# Altium schematic sheet FieldBUS_RTU.SchDoc
size A4; SheetNumber: 10; SheetTotal: 14
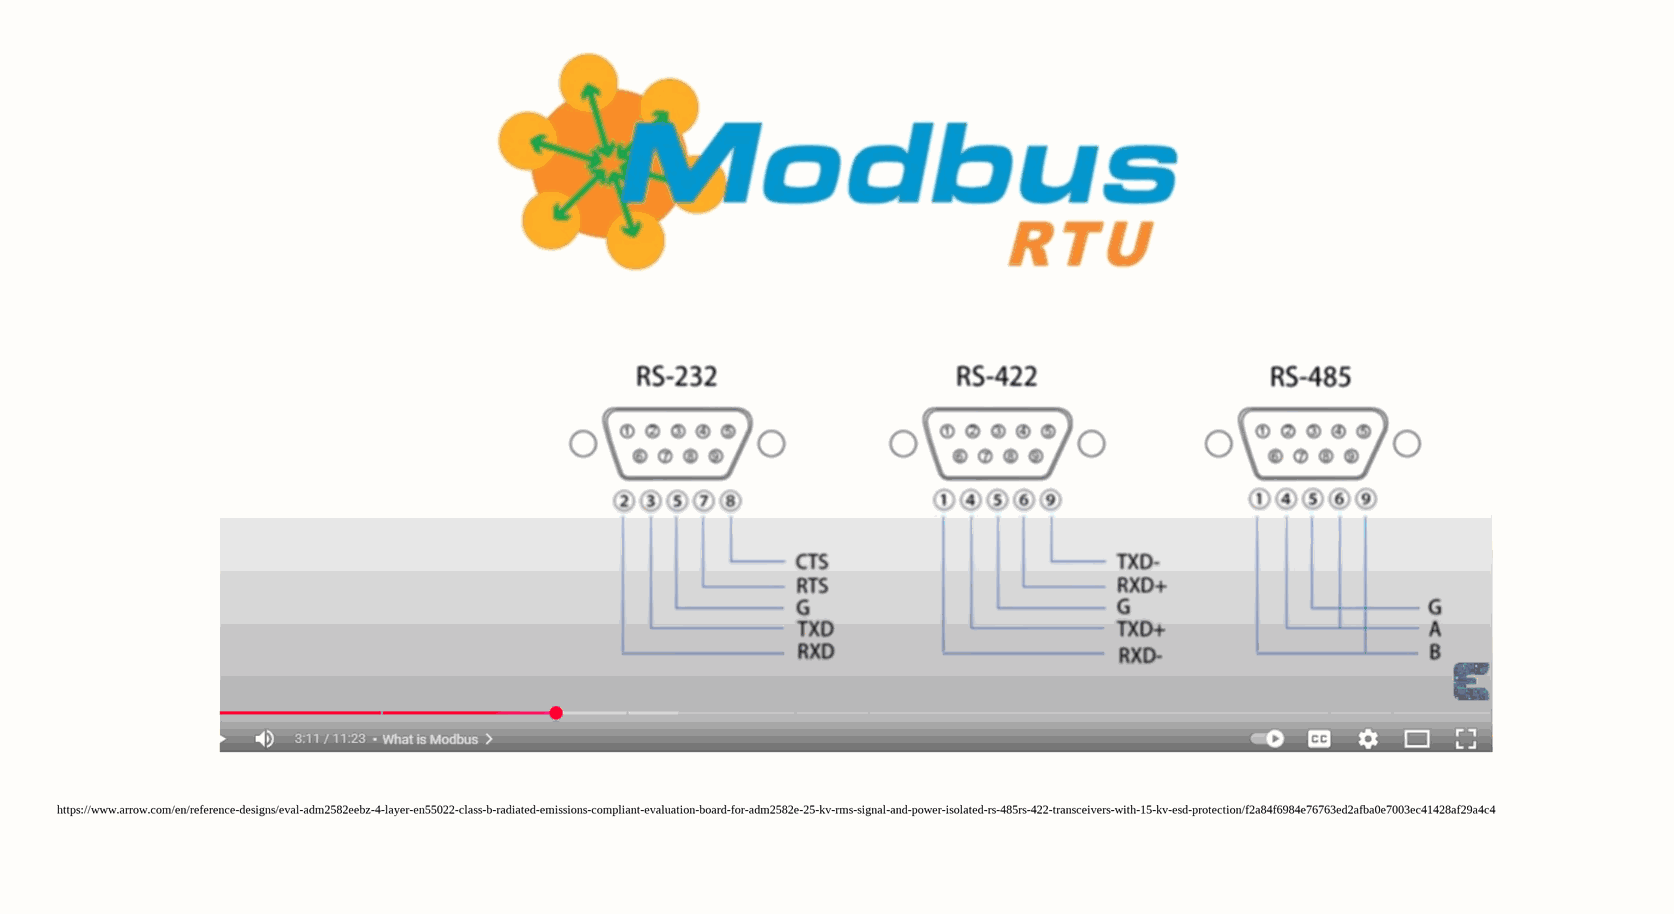
[diagram p0: FieldBUS_RTU.SchDoc, top left]
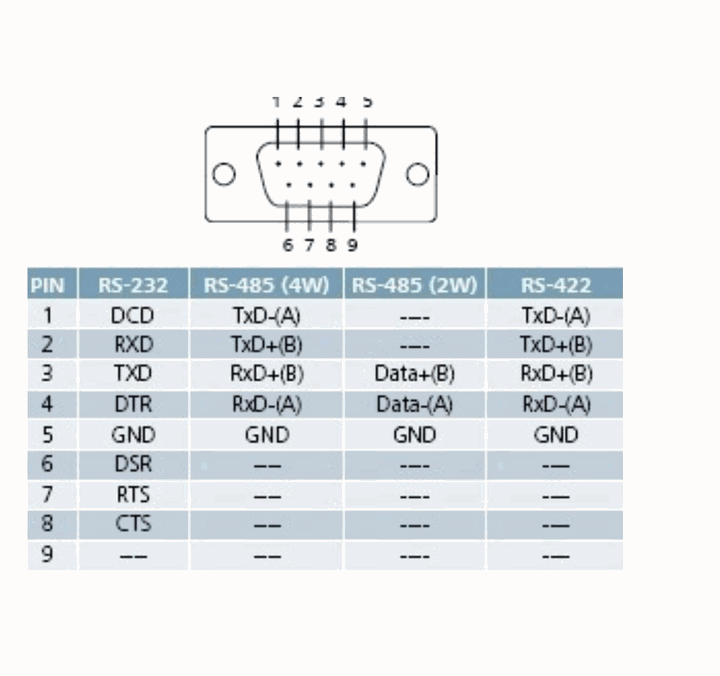
[diagram p1: FieldBUS_RTU.SchDoc, top right]
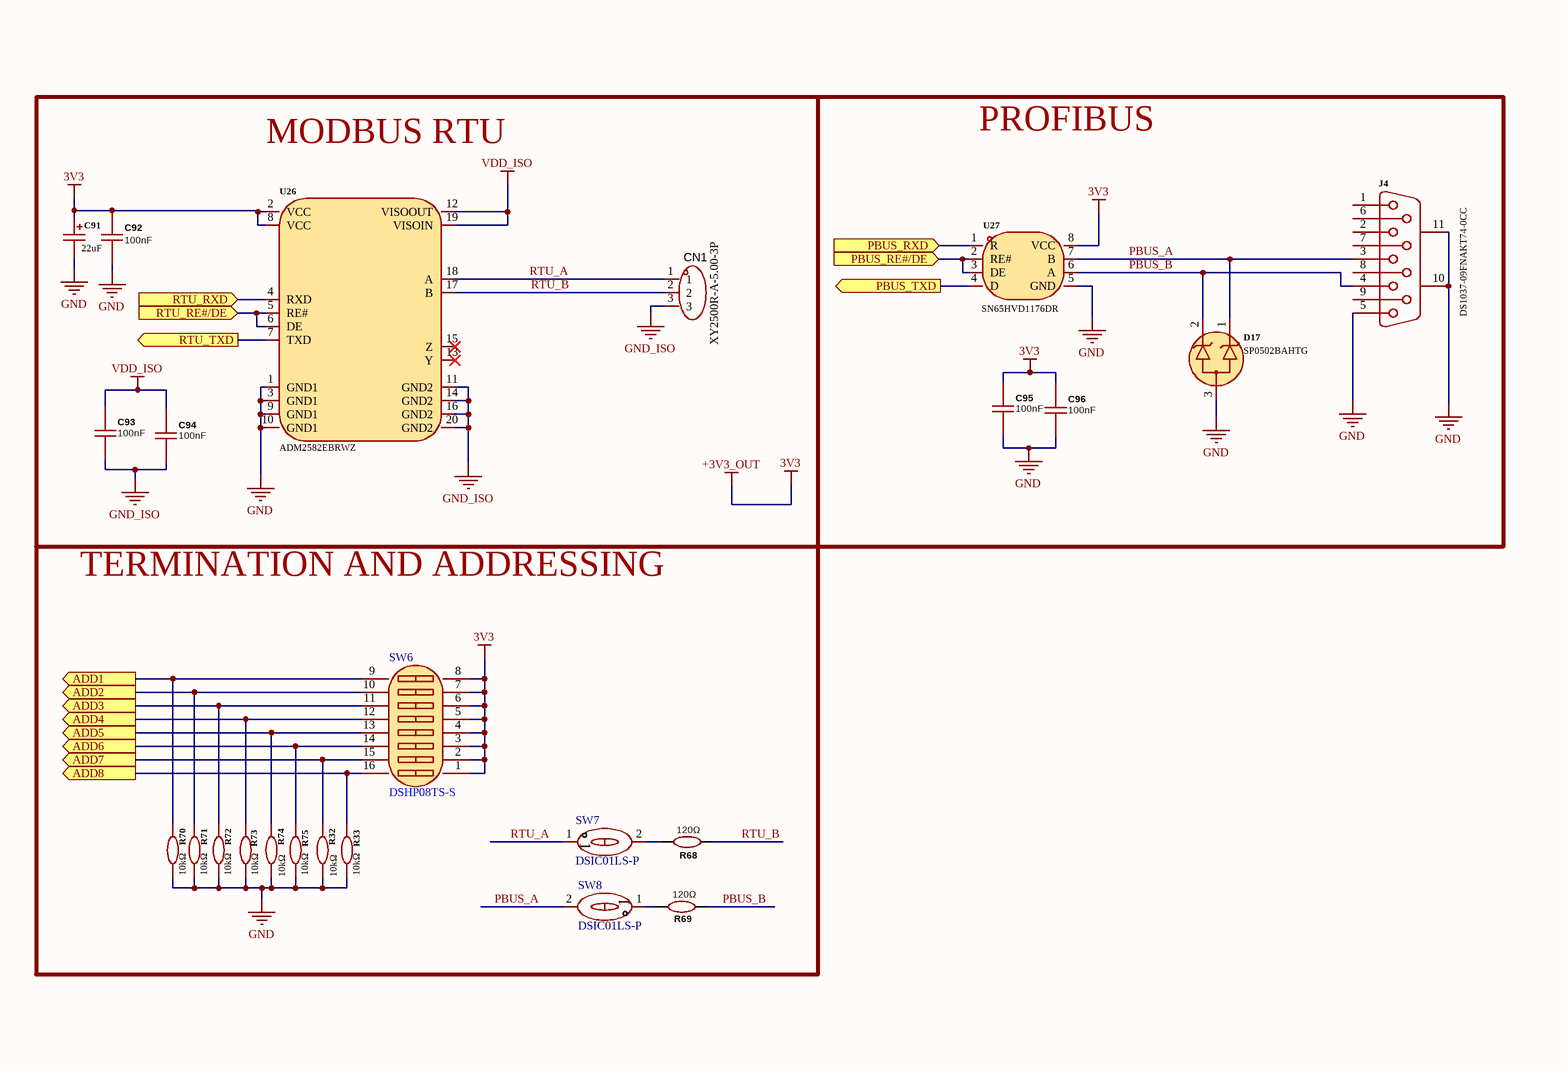
[diagram p2: FieldBUS_RTU.SchDoc, bottom left]
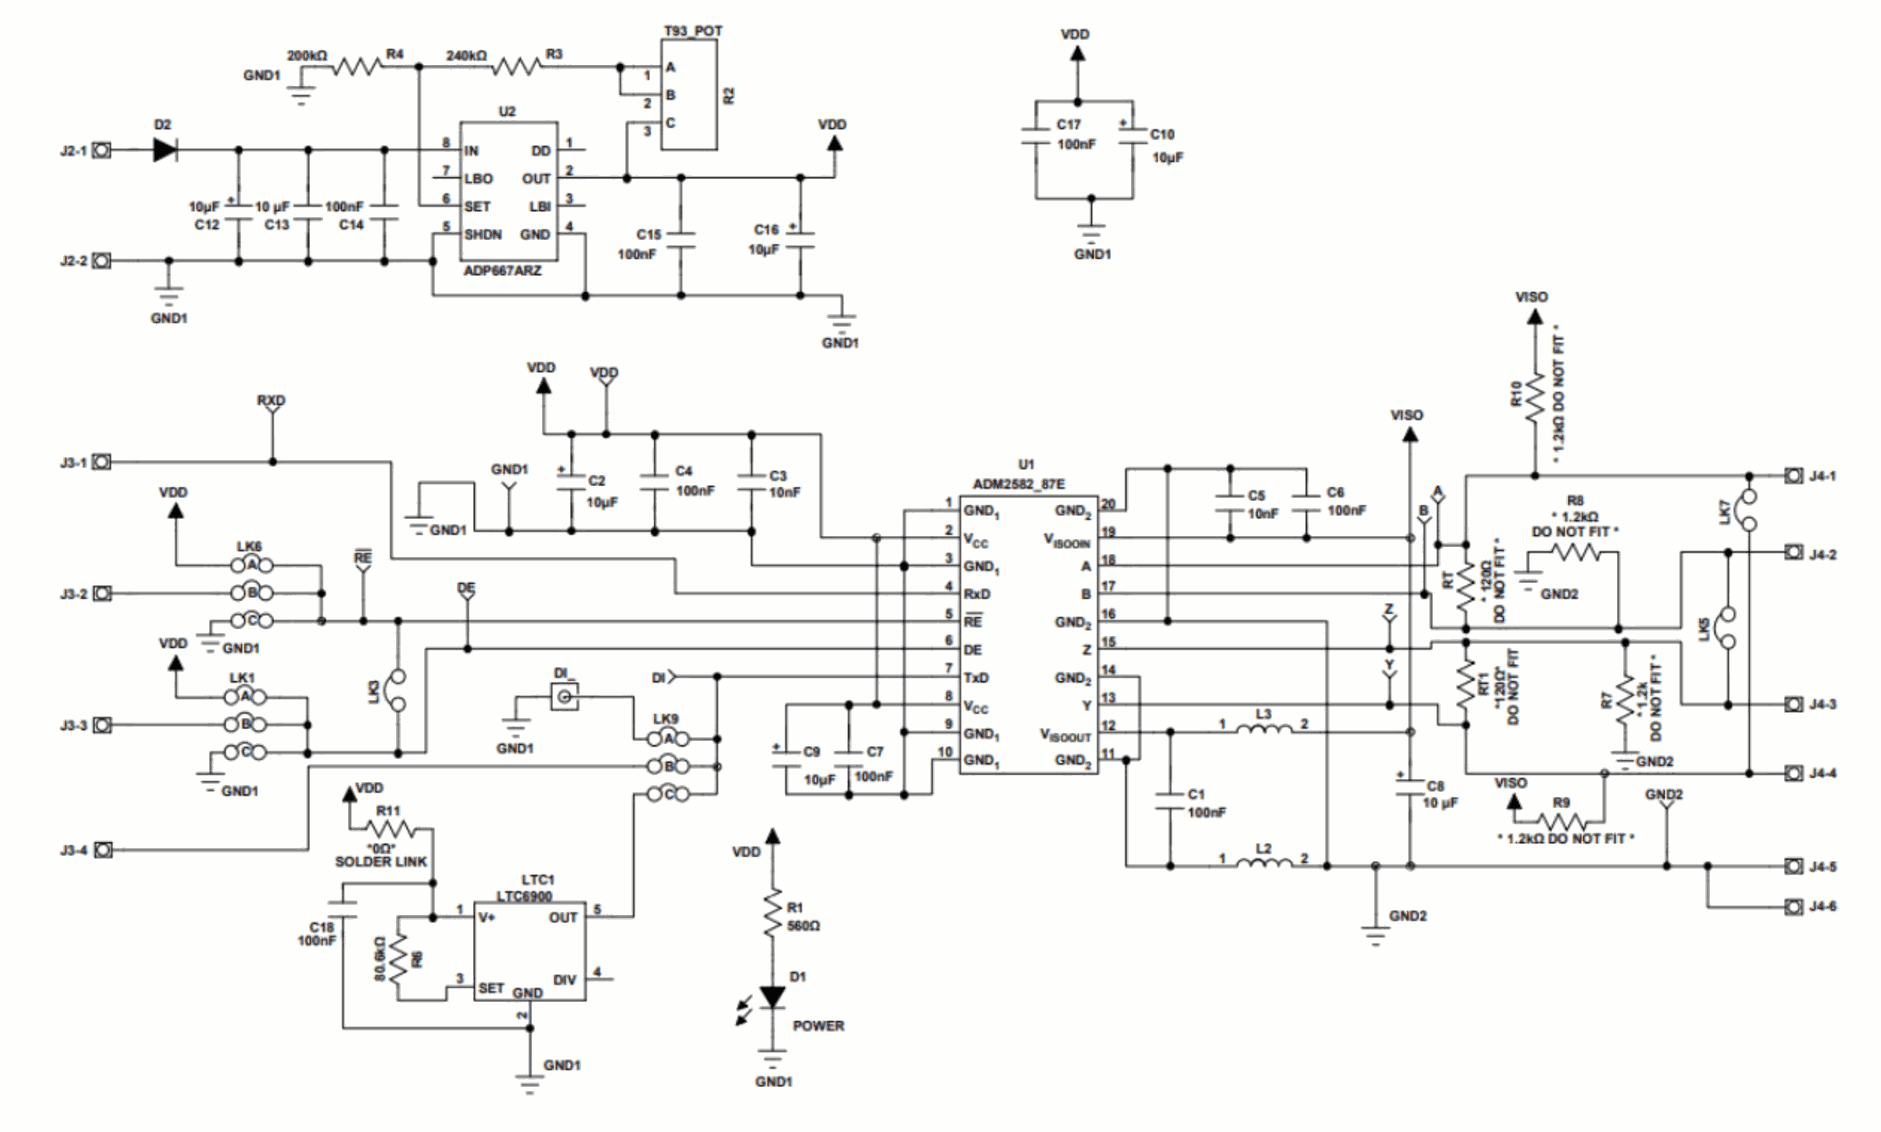
[diagram p3: FieldBUS_RTU.SchDoc, bottom right]

## Parts
C91  22uF  [CASE-A_3216]
C92  100nF  [C_0805]
C93  100nF  [C_0805]
C94  100nF  [C_0805]
C95  100nF  [C_0805]
C96  100nF  [C_0805]
CN1  XY2500R-A-5.00-3P  [CONN-TH_XY2500R-A-5.00-3P]
D17  SP0502BAHTG  [SOT-23-3_L2.9-W1.3-P1.90-LS2.4-BR]
J4  DS1037-09FNAKT74-0CC  [DSUB-TH_DS1037-09FNAKT74-0CC]
R32  10kΩ  [R_0603]
R33  10kΩ  [R_0603]
R68  120Ω  [R_1206]
R69  120Ω  [R_1206]
R70  10kΩ  [R_0603]
R71  10kΩ  [R_0603]
R72  10kΩ  [R_0603]
R73  10kΩ  [R_0603]
R74  10kΩ  [R_0603]
R75  10kΩ  [R_0603]
SW6  DSHP08TS-S  [SW-SMD_DSHP08TS-S]
SW7  DSIC01LS-P  [SW-SMD_2P-L3.5-W6.1-P2.54-LS9.8]
SW8  DSIC01LS-P  [SW-SMD_2P-L3.5-W6.1-P2.54-LS9.8]
U26  ADM2582EBRWZ  [SOIC-20_L13.0-W7.6-P1.27-LS10.3-BL]
U27  SN65HVD1176DR  [SOIC-8_L5.0-W4.0-P1.27-LS6.0-BL]

## Ports
ADD1 (out), ADD2 (out), ADD3 (out), ADD4 (out), ADD5 (out), ADD6 (out), ADD7 (out), ADD8 (out), PBUS_RE#/DE (in), PBUS_RXD (in), PBUS_TXD (out), RTU_RE#/DE (in), RTU_RXD (in), RTU_TXD (out)

## Nets
+3V3_OUT: C91.1 C92.2 C95.2 C96.2 SW6.1(A1) SW6.2(A2) SW6.3(A3) SW6.4(A4) SW6.5(A5) SW6.6(A6) SW6.7(A7) SW6.8(A8) U26.2(VCC) U26.8(VCC) U27.8(VCC)  [also labelled 3V3]
GND: C91.2 C92.1 C95.1 C96.1 D17.3(A) J4.5 J4.10(MH1) J4.11(MH2) R32.2 R33.2 R70.2 R71.2 R72.2 R73.2 R74.2 R75.2 U26.1(GND1) U26.3(GND1) U26.9(GND1) U26.10(GND1) U27.5(GND)
GND_ISO: C93.1 C94.1 CN1.3 U26.11(GND2) U26.14(GND2) U26.16(GND2) U26.20(GND2)
VDD_ISO: C93.2 C94.2 U26.12(VISOOUT) U26.19(VISOIN)
ADD1: R70.1 SW6.9(B8) ; port ADD1
ADD2: R71.1 SW6.10(B7) ; port ADD2
ADD3: R72.1 SW6.11(B6) ; port ADD3
ADD4: R73.1 SW6.12(B5) ; port ADD4
ADD5: R74.1 SW6.13(B4) ; port ADD5
ADD6: R75.1 SW6.14(B3) ; port ADD6
ADD7: R32.1 SW6.15(B2) ; port ADD7
ADD8: R33.1 SW6.16(B1) ; port ADD8
PBUS_A: D17.1(K1) J4.3 SW8.2(PIN2) U27.7(B)
PBUS_B: D17.2(K2) J4.4 R69.2 U27.6(A)
PBUS_RE#/DE: U27.2(RE#) U27.3(DE) ; port PBUS_RE#/DE
PBUS_RXD: U27.1(R) ; port PBUS_RXD
PBUS_TXD: U27.4(D) ; port PBUS_TXD
RTU_A: CN1.1 SW7.1(PIN1) U26.18(A)
RTU_B: CN1.2 R68.2 U26.17(B)
RTU_RE#/DE: U26.5(RE#) U26.6(DE) ; port RTU_RE#/DE
RTU_RXD: U26.4(RXD) ; port RTU_RXD
RTU_TXD: U26.7(TXD) ; port RTU_TXD
NetR68_1: R68.1 SW7.2(PIN2)
NetR69_1: R69.1 SW8.1(PIN1)

Not connected (* = marked no-connect by the designer): J4 1 2 6 7 8 9; U26 13(Y)* 15(Z)*

## Notes on the sheet
- https://www.arrow.com/en/reference-designs/eval-adm2582eebz-4-layer-en55022-class-b-radiated-emissions-compliant-evaluation-board-for-adm2582e-25-kv-rms-signal-and-power-isolated-rs-485rs-422-transceivers-with-15-kv-esd-protection/f2a84f6984e76763ed2afba0e7003ec41428af29a4c4
- MODBUS RTU
- PROFIBUS
- TERMINATION AND ADDRESSING
- Project Name:
- Size:
- Date:
- A4
- Version:
- Time:
- V1.4.0.0
- Sheet:
- Of
- File:

## Library data of the parts
C91 = TAJA226K010RNJ: Manufacturer: Kyocera AVX; Add into BOM: yes; Tolerance: ±10%; Voltage Rating: 10V; Equivalent Series Resistance(ESR): 3Ω@100kHz; Symbol: TAJA226K010RNJ; Device: TAJA226K010RNJ; LCSC Part Name: 22uF ±10% 10V; Supplier Part: C11366; Manufacturer Part: TAJA226K010RNJ; Supplier Footprint: CASE-A-3216-18(mm); JLCPCB Part Class: Extended Part; Supplier: LCSC; Convert to PCB: yes; Value: 22uF; Operating Temperature: -55℃~+125℃
C92-C96 = 100nF: Manufacturer Part: CC0805KRX7R9BB104; Manufacturer: YAGEO(国巨); nameAlias: Value; Supplier: LCSC; Supplier Part: C49678; JLCPCB Part Class: Basic Part; spicePre: C; spiceSymbolName: CC0805KRX7R9BB104
CN1 = XY2500R-A-5.00-3P: Manufacturer: XINLAIYA(新莱亚); Add into BOM: yes; Connector Type: Board Side/Socket - Open; Number of Positions or Pins: 1x3P; Pitch: 5mm; Number of PINs Per Row: 3; Current Rating: 15A; Voltage Rating (Max): 300V; Symbol: XY2500R-A-5.00-3P; Device: XY2500R-A-5.00-3P; LCSC Part Name: 1x3P 5mm 排数:1 每排P数:3; Supplier Part: C505798; Manufacturer Part: XY2500R-A-5.00-3P; Supplier Footprint: 弯插,P=5mm; JLCPCB Part Class: Extended Part; Datasheet: https://item.szlcsc.com/datasheet/XY2500R-A-5.00-3P/519088.html; Supplier: LCSC; Convert to PCB: yes; Color: Green; Mounting Type: Right-Angle Pin; Number of Pins: 3P; Number of Rows: 1
D17 = SP0502BAHTG: Manufacturer: Littelfuse(美国力特); Add into BOM: yes; Polarity: Unidirectional; Reverse Stand-Off Voltage (Vrwm): 5.5V; Clamping Voltage: 12V; Reverse Leakage Current (Ir): 100nA; Number of Channels: 2; level of protection: IEC 61000-4-2; Type: TVS; Junction Capacitance: 30pF; Symbol: SP0502BAHTG; Device: SP0502BAHTG; LCSC Part Name: SP0502BAHTG; Supplier Part: C207261; Manufacturer Part: SP0502BAHTG; Supplier Footprint: SOT-23; JLCPCB Part Class: Extended Part; Datasheet: https://item.szlcsc.com/datasheet/SP0502BAHTG/208380.html; Supplier: LCSC; Convert to PCB: yes; Peak Pulse Current (Ipp): -; Peak Pulse Power Dissipation (Ppp): -; Voltage - Breakdown: -; Operating Temperature: -40℃~+125℃
J4 = DS1037-09FNAKT74-0CC: Manufacturer: CONNFLY; Add into BOM: yes; Connector Type: Standard D-Sub; Gender: Mother; Current Rating-Signal (Max): 3A; Symbol: DS1037-09FNAKT74-0CC; Device: DS1037-09FNAKT74-0CC; LCSC Part Name: D-Sub 母 P数:9P 1200/盒 带六角螺丝; Supplier Part: C75749; Manufacturer Part: DS1037-09FNAKT74-0CC; Supplier Footprint: 弯插; JLCPCB Part Class: Extended Part; Datasheet: https://atta.szlcsc.com/upload/public/pdf/source/20241014/2E52C80238FADC5DB5725AE5600FD7FE.pdf; Supplier: LCSC; Convert to PCB: yes; Number of Pins: 9P; Mounting Style: Bend-in; Number of Rows: 2; Current Rating-Power (Max): -; Rated Voltage (Max): -; Colour: Black; Operating Temperature Range: -40℃~+105℃
R32 R33 R70-R75 = RC0603FR-0710KL: Manufacturer: YAGEO(国巨); Add into BOM: yes; Tolerance: ±1%; Temperature Coefficient: ±100ppm/℃; Symbol: RC0603FR-0710KL; Device: RC0603FR-0710KL; LCSC Part Name: 厚膜电阻 10kΩ ±1% 100mW; Supplier Part: C98220; Manufacturer Part: RC0603FR-0710KL; Supplier Footprint: 0603; JLCPCB Part Class: Extended Part; Datasheet: https://atta.szlcsc.com/upload/public/pdf/source/20180927/C295883_E8D83085EA81BD7DE0B2B681138C15EE.pdf; Supplier: LCSC; Convert to PCB: yes; Type: Thick Film Resistors; Value: 10kΩ; Operating Temperature Range: -55℃~+155℃
R68 R69 = 120Ω: Manufacturer: YAGEO(国巨); Manufacturer Part: RC1206FR-07120RL; nameAlias: Value; Supplier: LCSC; Supplier Part: C114928; JLCPCB Part Class: Extended Part; spicePre: R; spiceSymbolName: RC1206FR-07120RL
SW6 = DSHP08TS-S: Manufacturer: XKB Connectivity(中国星坤); Add into BOM: yes; Circuit: SPST; Number of Positions: 8Bit; Pin Style: Gull Wing; Current Rating: 25mA; Voltage Rating: 24V; Operating Life: 3千次; Symbol: DSHP08TS-S; Device: DSHP08TS-S; Supplier: LCSC; Supplier Part: C319047; Manufacturer Part: DSHP08TS-S; JLCPCB Part Class: Extended Part; LCSC Part Name: 间距1.27mm 平拨,凹槽式 8位拨码开关; Supplier Footprint: SMD-16P,5.4x11.8mm; Datasheet: https://atta.szlcsc.com/upload/public/pdf/source/20211009/11BE85C99D2C85B0991AF4F9D6EB8BDE.pdf; Convert to PCB: yes; Type: 平拨,凹槽式; Lead Pitch: 1.27mm; Operating Temperature: -20℃~+70℃; Color: Black
SW7 SW8 = DSIC01LS-P_C600988: Manufacturer: XKB Connection(中国星坤); Add into BOM: yes; Circuit: SPST; Number of Positions: 1; Current Rating: 25mA; Voltage Rating: 24V; Operating Life: 3,000 Cycles; Symbol: DSIC01LS-P_C600988; Device: DSIC01LS-P_C600988; LCSC Part Name: 平拨,凸起式 1位拨码开关; Supplier Part: C600988; Manufacturer Part: DSIC01LS-P; Supplier Footprint: SMD,6.2x3.5mm; JLCPCB Part Class: Extended Part; Datasheet: https://item.szlcsc.com/datasheet/DSIC01LS-P/631008.html; Supplier: LCSC; Convert to PCB: yes; Type: Slide, Rocked; Termination Style: Gull Wing; Lead Pitch: -; Operating Temperature: -20℃~+70℃; Color: Black
U26 = ADM2582EBRWZ: Manufacturer: ADI(亚德诺); Add into BOM: yes; Communication Mode: Full-Duplex；Half-Duplex; Voltage - Supply: 3.3V；5V; Output Voltage: 3.3V; Isolation Voltage(Vrms): 2500; CMTI(kV/us): 25kV/us; Symbol: ADM2582EBRWZ; Device: ADM2582EBRWZ; LCSC Part Name: 信号和电源隔离的RS-485收发器，具有±15 kV静电放电保护; Supplier Part: C18532; Manufacturer Part: ADM2582EBRWZ; Supplier Footprint: SOIC-20-300mil; JLCPCB Part Class: Extended Part; Datasheet: https://item.szlcsc.com/datasheet/ADM2582EBRWZ/19232.html; Supplier: LCSC; Convert to PCB: yes; Operating Temperature: -40℃~+85℃
U27 = SN65HVD1176DR: Manufacturer: TI(德州仪器); Add into BOM: yes; Number of Drivers: 1; Voltage - Supply: 4.75V~5.25V; Data Rate: 40Mbps; Symbol: SN65HVD1176DR; Device: SN65HVD1176DR; LCSC Part Name: SN65HVD1176, SN75HVD1176 PROFIBUS RS-485 收发器; Supplier Part: C123783; Manufacturer Part: SN65HVD1176DR; Supplier Footprint: SOIC-8; JLCPCB Part Class: Extended Part; Datasheet: https://www.ti.com/cn/lit/gpn/sn65hvd1176; Supplier: LCSC; Convert to PCB: yes; Type: transceiver; Number of Receivers: 1; Operating Temperature: -40℃~+85℃